# EAGLE design growinov0 (EAGLE 7.1.0)
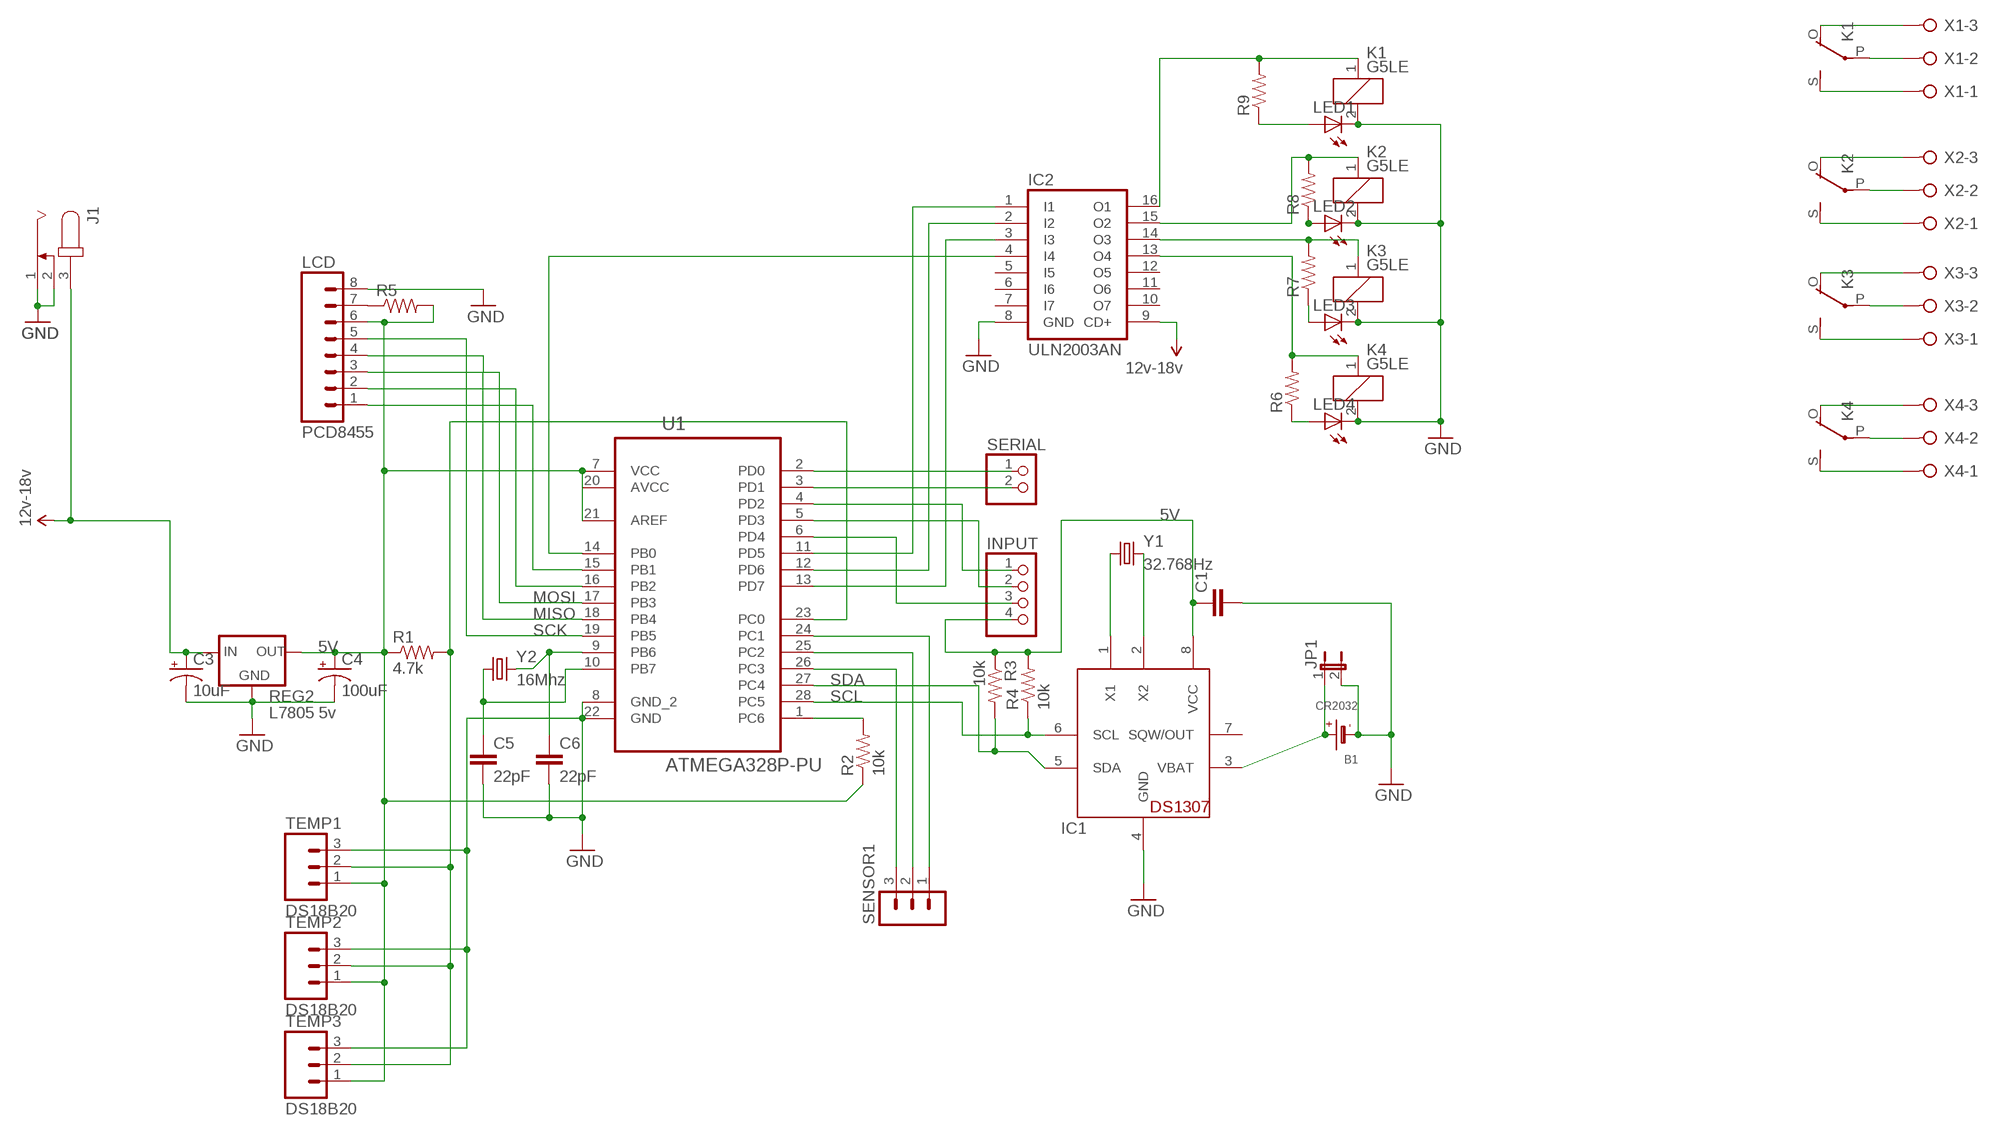
[diagram p0: schematic, sheet 1]

## Parts
B1  CR2032  BATTERYCR2032  [CR2032]
C1  CAPPTH1  [CAP-PTH-5MM]
C3  10uF  CAP_POLPTH2  [CPOL-RADIAL-10UF-25V]
C4  100uF  CAP_POLPTH1  [CPOL-RADIAL-100UF-25V]
C5  22pF  CAPKIT  [CAP-PTH-SMALL-KIT]
C6  22pF  CAPKIT  [CAP-PTH-SMALL-KIT]
IC1  DS1307  [DIL08]
IC2  ULN2003AN  [DIL16]
INPUT  PINHD-1X4  [1X04]
J1  JACK-PLUG0  [SPC4077]
JP1  JUMPER-2PTH  [1X02]
K1  G5LE  [G5LE]
K2  G5LE  [G5LE]
K3  G5LE  [G5LE]
K4  G5LE  [G5LE]
LCD  PCD8455  M081X08  [1X08]
LED1  LED3MM  [LED3MM]
LED2  LED3MM  [LED3MM]
LED3  LED3MM  [LED3MM]
LED4  LED3MM  [LED3MM]
R1  4.7k  RESISTORPTH-1/4W  [AXIAL-0.4]
R2  10k  RESISTORPTH-1/4W  [AXIAL-0.4]
R3  10k  RESISTORPTH-1/4W  [AXIAL-0.4]
R4  10k  RESISTORPTH-1/4W  [AXIAL-0.4]
R5  RESISTORPTH-1/4W-VERT  [AXIAL-0.1]
R6  RESISTORPTH-1/4W-VERT  [AXIAL-0.1]
R7  RESISTORPTH-1/4W-VERT  [AXIAL-0.1]
R8  RESISTORPTH-1/4W-VERT  [AXIAL-0.1]
R9  RESISTORPTH-1/4W-VERT  [AXIAL-0.1]
REG2  L7805 5v  V_REG_78XXSIDE  [78XXL]
SENSOR1  MA03-1  [MA03-1]
SERIAL  PINHD-1X2  [1X02]
TEMP1  DS18B20  M03POLAR  [MOLEX-1X3]
TEMP2  DS18B20  M03POLAR  [MOLEX-1X3]
TEMP3  DS18B20  M03POLAR  [MOLEX-1X3]
U1  ATMEGA328P-PU  [DIP254P762X457-28]
X1  W237-3E  [W237-3E]
X2  W237-3E  [W237-3E]
X3  W237-3E  [W237-3E]
X4  W237-3E  [W237-3E]
Y1  32.768Hz  CRYSTALTC26H  [TC26H]
Y2  16Mhz  CRYSTALHC49US  [HC49US]

## Nets
5V: C1.1 C4.1(+) IC1.8(VCC) INPUT.4 LCD.6 R1.P$1 R2.P$1 R3.P$1 R4.P$2 R5.P$2 REG2.OUT TEMP1.1 TEMP2.1 TEMP3.1 U1.7(VCC) U1.20(AVCC) U1.21(AREF)
GND: B1.- C1.2 C3.2(-) C4.2(-) C5.2 C6.2 IC1.4(GND) IC2.8(GND) J1.1 J1.2 JP1.2 K1.2 K2.2 K3.2 K4.2 LCD.8 LED1.K(C) LED2.K(C) LED3.K(C) LED4.K(C) REG2.GND TEMP1.3 TEMP2.3 TEMP3.3 U1.8(GND_2) U1.22(GND)
MISO: LCD.4 U1.18(PB4)
MOSI: LCD.3 U1.17(PB3)
N$1: B1.+ IC1.3(VBAT) JP1.1
N$2: R1.P$2 TEMP1.2 TEMP2.2 TEMP3.2 U1.23(PC0)
N$3: IC1.1(X1) Y1.1
N$4: IC1.2(X2) Y1.2
N$5: R2.P$2 U1.1(PC6)
N$6: K1.O(2:O) X1.3
N$7: IC2.1(I1) U1.11(PD5)
N$8: IC2.2(I2) U1.12(PD6)
N$9: IC2.3(I3) U1.13(PD7)
N$10: IC2.4(I4) U1.14(PB0)
N$11: K1.S(2:S) X1.1
N$12: C6.1 U1.9(PB6) Y2.2
N$13: C5.1 U1.10(PB7) Y2.1
N$14: LCD.2 U1.16(PB2)
N$15: LCD.1 U1.15(PB1)
N$16: IC2.16(O1) K1.1 R9.P$2
N$17: IC2.15(O2) K2.1 R8.P$2
N$18: IC2.14(O3) K3.1 R7.P$2
N$19: IC2.13(O4) K4.1 R6.P$2
N$21: K1.P(2:P) X1.2
N$22: K4.O(2:O) X4.3
N$23: K4.P(2:P) X4.2
N$24: K4.S(2:S) X4.1
N$25: K3.S(2:S) X3.1
N$26: K3.P(2:P) X3.2
N$27: K3.O(2:O) X3.3
N$28: K2.S(2:S) X2.1
N$29: K2.P(2:P) X2.2
N$30: K2.O(2:O) X2.3
N$31: SERIAL.1 U1.2(PD0)
N$32: SERIAL.2 U1.3(PD1)
N$33: INPUT.1 U1.4(PD2)
N$34: INPUT.2 U1.5(PD3)
N$35: INPUT.3 U1.6(PD4)
N$36: SENSOR1.1 U1.24(PC1)
N$37: SENSOR1.2 U1.25(PC2)
N$38: SENSOR1.3 U1.26(PC3)
N$39: LCD.7 R5.P$1
N$40: LED2.A R8.P$1
N$41: LED4.A R6.P$1
N$42: LED3.A R7.P$1
N$43: LED1.A R9.P$1
SCK: LCD.5 U1.19(PB5)
SCL: IC1.6(SCL) R4.P$1 U1.28(PC5)
SDA: IC1.5(SDA) R3.P$2 U1.27(PC4)
VIN: C3.1(+) IC2.9(CD+) J1.3 REG2.IN ; supply symbol labelled 12v-18v
Unconnected: IC1.7(SQW/OUT) IC2.5(I5) IC2.6(I6) IC2.7(I7) IC2.10(O7) IC2.11(O6) IC2.12(O5)

## Library data of the parts
B1 = microbuilder:BATTERY: CR1220 SMT - Digikey: 3001K-ND
C1 = SparkFun-Capacitors:CAP: Capacitor Standard 0603 ceramic capacitor, and 0.1" leaded capacitor.
C3 C4 = SparkFun-Passives:CAP_POL: Capacitor Polarized These are standard SMD and PTH capacitors. Normally 10uF, 47uF, and 100uF in electrolytic and tantalum varieties. Always verify the external diameter of the through hole cap, it varies with capacity, voltage, and manufacturer. The EIA devices should be standard.
C5 C6 = SparkFun-Passives:CAP: Capacitor Standard 0603 ceramic capacitor, and 0.1" leaded capacitor.
IC1 = adafruit:DS1307: DS1307 Real time clock (RTC) with battery backup ability. Talk to it via i2c
IC2 = uln-udn:ULN2003A: DRIVER ARRAY
INPUT = pinhead:PINHD-1X4: PIN HEADER
J1 = con-jack:JACK-PLUG: DC POWER JACK Power Jack, DC, Right Angle, Through Hole, Rated 5A at 16VDC, PC Terminals Distributor: Farnell (www.Farnell.de) Drawing: 84N1161.pdf / 84N1162.pdf Manufacturer: SPC Technology (www.spctechnology.com) Type: SPC4077 / SPC 4078; OC_FARNELL: unknown; OC_NEWARK: unknown
JP1 = SparkFun-Retired:JUMPER-2: Jumper Basic 0.1" spaced jumper. Use with breakaway headers.
K1-K4 = relay:G5LE: RELAY 1 x switch, 10 A/120 V AC, 8 A/30 V DC, Omron; OC_FARNELL: unknown; OC_NEWARK: unknown
LCD = SparkFun-Connectors:M08: Header 8 Standard 8-pin 0.1" header. Use with straight break away headers (SKU : PRT-00116), right angle break away headers (PRT-00553), swiss pins (PRT-00743), machine pins (PRT-00117), and female headers (PRT-00115).
LED1-LED4 = led:LED: LED OSRAM: - CHIPLED LG R971, LG N971, LY N971, LG Q971, LY Q971, LO R971, LY R971 LH N974, LH R974 LS Q976, LO Q976, LY Q976 LO Q996 - Hyper CHIPLED LW Q18S LB Q993, LB Q99A, LB R99A - SideLED LS A670, LO A670, LY A670, LG A670, LP A670 LB A673, LV A673, LT A673, LW A673 LH A674 LY A675 LS A676, LA A676, LO A676, LY A676, LW A676 LS A679, LY A679, LG A679 - Hyper Micro SIDELED® LS Y876, LA Y876, LO Y876, LY Y876 LT Y87S - SmartLED LW L88C, LW L88S LB L89C, LB L89S, LG L890 LS L89K, LO L89K, LY L89K LS L896, LA L896, LO L896, LY L896 - TOPLED LS T670, LO T670, LY T670, LG T670, LP T670 LSG T670, LSP T670, LSY T670, LOP T670, LYG T670 LG T671, LOG T671, LSG T671 LB T673, LV T673, LT T673, LW T673 LH T674 LS T676, LA T676, LO T676, LY T676, LB T676, LH T676, LSB T676, LW T676 LB T67C, LV T67C, LT T67C, LS T67K, LO T67K, LY T67K, LW E67C LS E67B, LA E67B, LO E67B, LY E67B, LB E67C, LV E67C, LT E67C LW T67C LS T679, LY T679, LG T679 LS T770, LO T770, LY T770, LG T770, LP T770 LB T773, LV T773, LT T773, LW T773 LH T774 LS E675, LA E675, LY E675, LS T675 LS T776, LA T776, LO T776, LY T776, LB T776 LHGB T686 LT T68C, LB T68C - Hyper Mini TOPLED® LB M676 - Mini TOPLED Santana® LG M470 LS M47K, LO M47K, LY M47K Source: http://www.osram.convergy.de LUXEON: - LUMILED® LXK2-PW12-R00, LXK2-PW12-S00, LXK2-PW14-U00, LXK2-PW14-V00 LXK2-PM12-R00, LXK2-PM12-S00, LXK2-PM14-U00 LXK2-PE12-Q00, LXK2-PE12-R00, LXK2-PE12-S00, LXK2-PE14-T00, LXK2-PE14-U00 LXK2-PB12-K00, LXK2-PB12-L00, LXK2-PB12-M00, LXK2-PB14-N00, LXK2-PB14-P00, LXK2-PB14-Q00 LXK2-PR12-L00, LXK2-PR12-M00, LXK2-PR14-Q00, LXK2-PR14-R00 LXK2-PD12-Q00, LXK2-PD12-R00, LXK2-PD12-S00 LXK2-PH12-R00, LXK2-PH12-S00 LXK2-PL12-P00, LXK2-PL12-Q00, LXK2-PL12-R00 Source: www.luxeon.com KINGBRIGHT: KA-3528ASYC Source: www.kingbright.com
R1 R3 R4 = SparkFun-Passives:RESISTOR: Resistor Basic schematic elements and footprints for 0603, 1206, and PTH resistors.
R2 R5-R9 = SparkFun-Resistors:RESISTOR: Resistor Basic schematic elements and footprints for 0603, 1206, and PTH resistors.
REG2 = SparkFun-PowerIC:V_REG_78XX: Voltage Regulator Standard 7805 5V regulator. IGO (Input Ground Output). Spark Fun Electronics SKU : COM-00107
SENSOR1 = con-lstb:MA03-1: PIN HEADER; OC_FARNELL: unknown; OC_NEWARK: unknown
SERIAL = pinhead:PINHD-1X2: PIN HEADER
TEMP1-TEMP3 = SparkFun-Connectors:M03: Header 3 Standard 3-pin 0.1" header. Use with straight break away headers (SKU : PRT-00116), right angle break away headers (PRT-00553), swiss pins (PRT-00743), machine pins (PRT-00117), and female headers (PRT-00115). Molex polarized connector foot print use with SKU : PRT-08232 with associated crimp pins and housings.
U1 = Atmel_By_element14_Batch_1-00:ATMEGA328P-PU: 8-bit Microcontroller with In-System Programmable Flash; MPN: ATMEGA328P-PU; OC_FARNELL: 1715487; OC_NEWARK: 15R0268; PACKAGE: PDIP-28; SUPPLIER: Atmel
X1-X4 = con-wago-508:W237-3E: WAGO SREW CLAMP; OC_FARNELL: unknown; OC_NEWARK: unknown
Y1 Y2 = SparkFun-FreqCtrl:CRYSTAL: Various standard crystals. Proven footprints. Spark Fun Electronics SKU : COM-00534

## Board
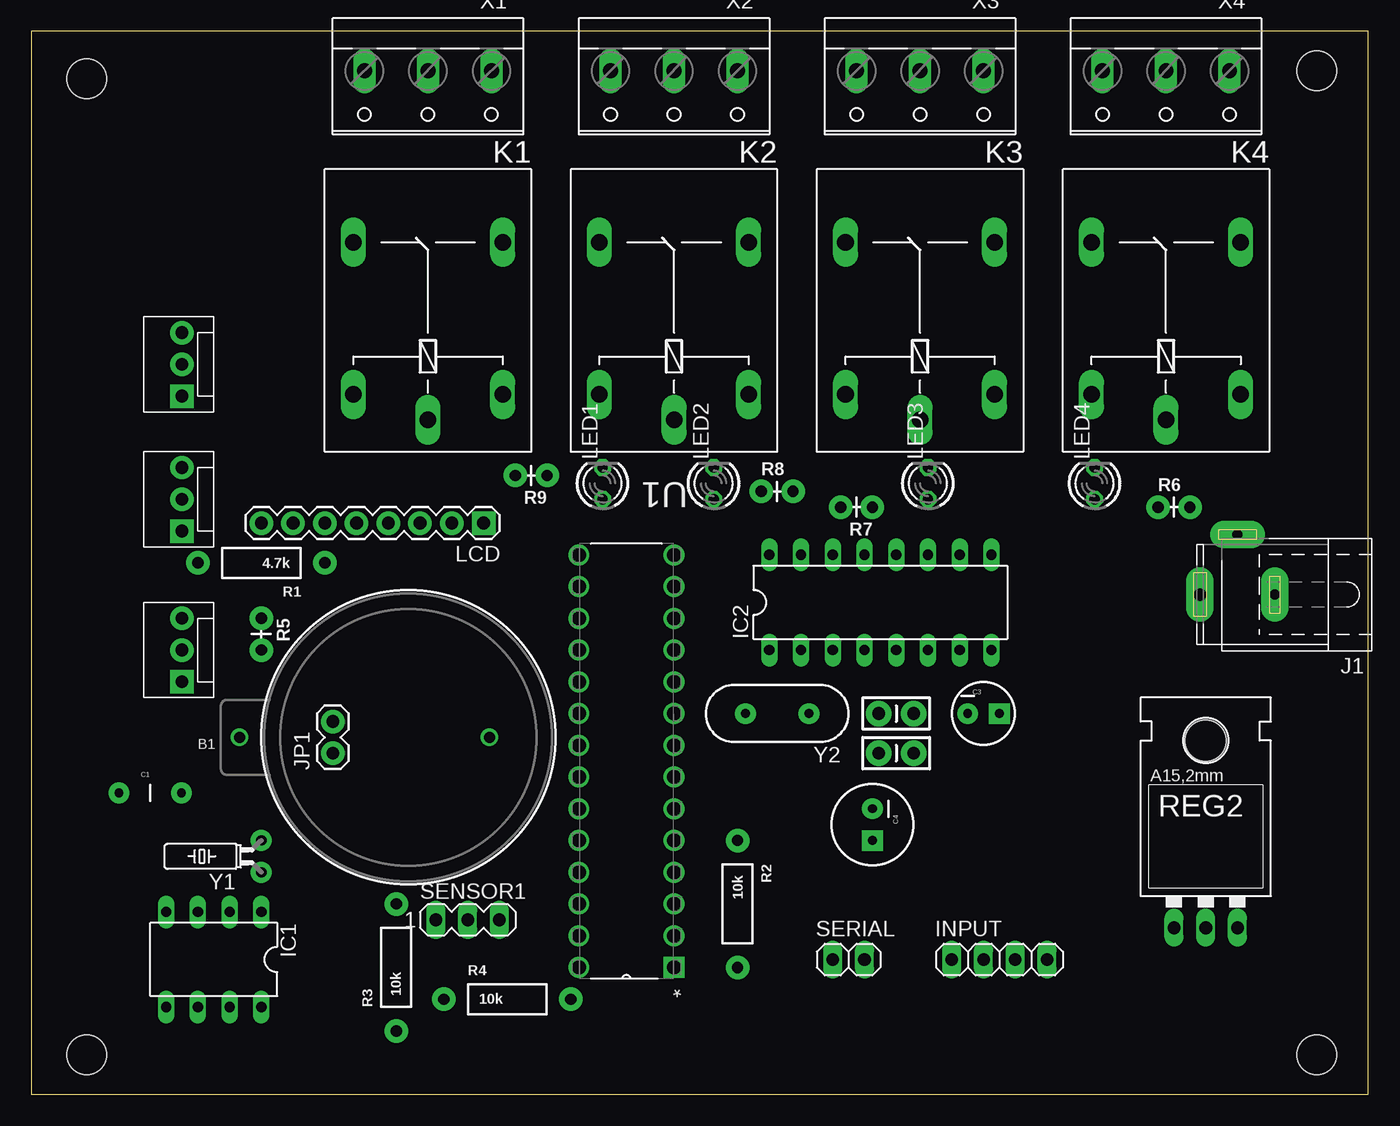
[diagram p1: board, top side]
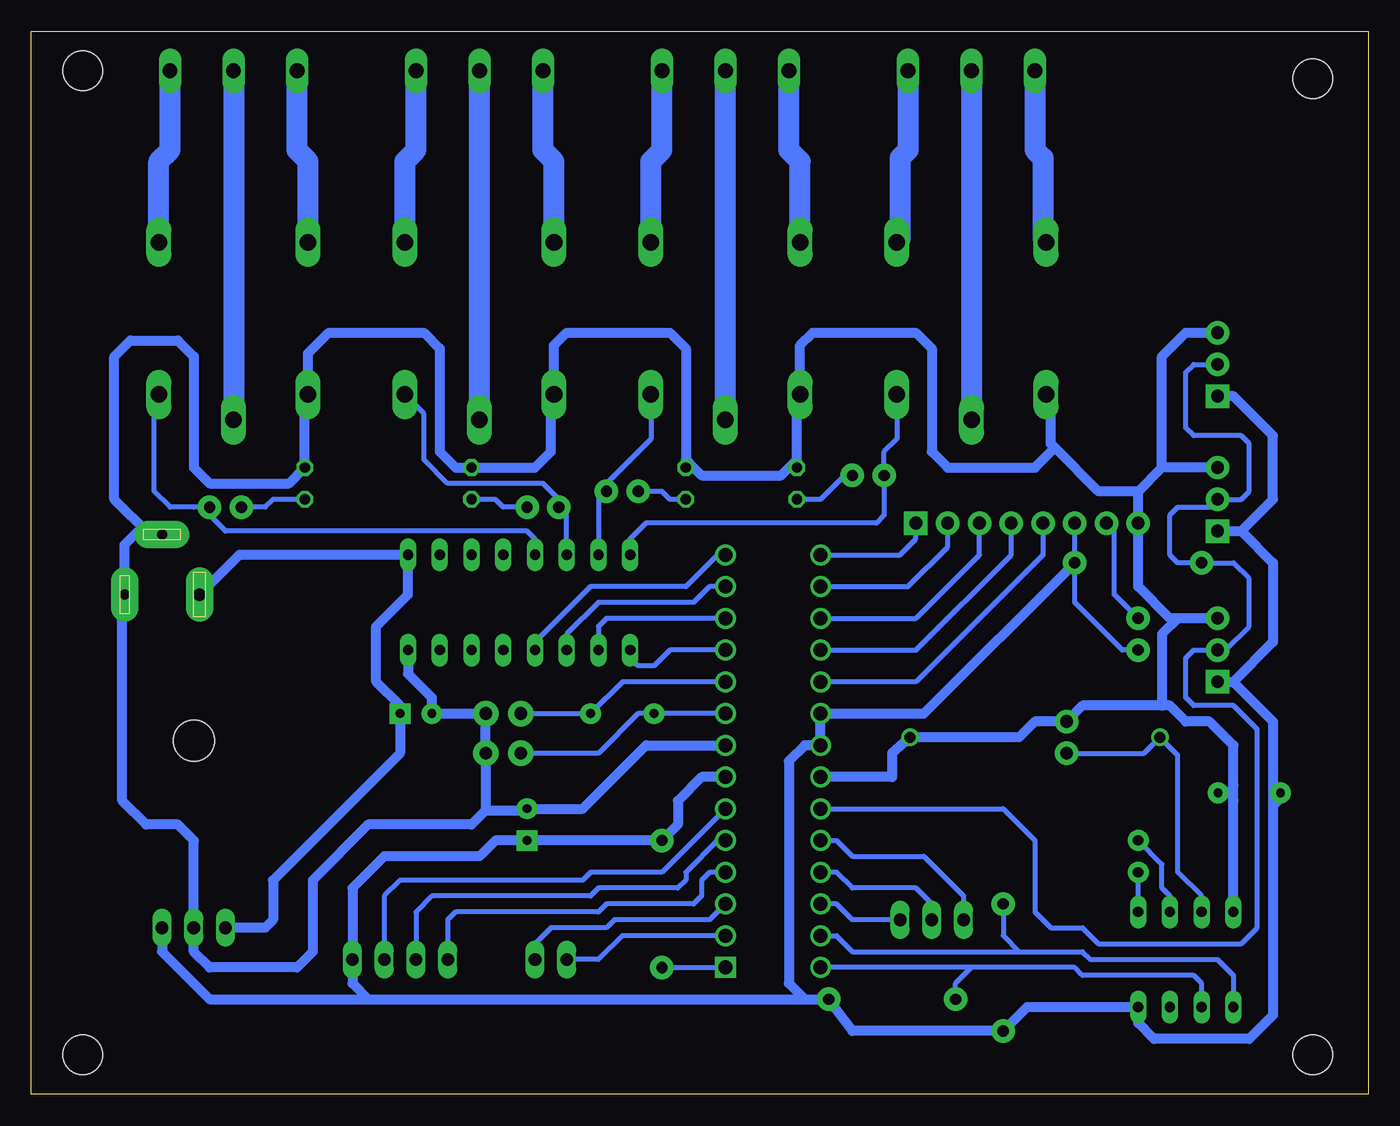
[diagram p2: board, bottom side, seen from below]

Size 106.98 x 85.08 mm. Coordinates in mm from the lower left corner, seen from the top.
Outline: 0,0 106.98,0 106.98,85.08 0,85.08 0,0
Copper layers (1*16): Top 0.035mm / dielectric 1.5mm / Bottom 0.035mm
Design rules "default": minimum track width 10mil, minimum drill 24mil, track to track 8mil, track to pad 8mil, pad to pad 8mil, via to via 8mil, smd to smd 8mil, copper to edge 40mil, drill to drill 8mil, minimum pad ring 10mil, minimum via ring 8mil, stop-mask expansion 4mil, vias tented up to drill 0mil, thermal gap 10mil
Holes 3.2 mm at 4.45,81.28 102.87,81.91 102.87,3.17 4.45,3.17

### Footprints (pad centres in the part's own frame; a part is rotated, then mirrored left to right if it is on the bottom)
CR2032 = drill 0.9: + 10,0; - -10,0
CAP-PTH-5MM = drill 0.7 pad 1.651: 1 -2.5,0; 2 2.5,0
CPOL-RADIAL-10UF-25V = drill 0.7 pad 1.651 square: 1 1.27,0 | drill 0.7 pad 1.651: 2 -1.27,0
CPOL-RADIAL-100UF-25V = drill 0.7 pad 1.651 square: 1 1.27,0 | drill 0.7 pad 1.651: 2 -1.27,0
CAP-PTH-SMALL-KIT = drill 1.016 pad 2.032: 1 -1.397,0; 2 1.397,0
DIL08 = drill 0.813 long: 1 -3.81,-3.81; 2 -1.27,-3.81; 3 1.27,-3.81; 4 3.81,-3.81; 5 3.81,3.81; 6 1.27,3.81; 7 -1.27,3.81; 8 -3.81,3.81
DIL16 = drill 0.813 long: 1 -8.89,-3.81; 2 -6.35,-3.81; 3 -3.81,-3.81; 4 -1.27,-3.81; 5 1.27,-3.81; 6 3.81,-3.81; 7 6.35,-3.81; 8 8.89,-3.81; 9 8.89,3.81; 10 6.35,3.81; 11 3.81,3.81; 12 1.27,3.81; 13 -1.27,3.81; 14 -3.81,3.81; 15 -6.35,3.81; 16 -8.89,3.81
1X04 = drill 1.016 long: 1 -3.81,0; 2 -1.27,0; 3 1.27,0; 4 3.81,0
SPC4077 = drill 0.8 pad 2.184 long: 1 -3,0; 2 0,-4.8 | drill 1 pad 2.184 long: 3 3,0
1X02 = drill 1.016 pad 1.88: 1 0,0; 2 2.54,0
G5LE = drill 1.321 long: 1 -7.493,-5.969; 2 -7.493,5.969; O 4.699,5.969; P -9.525,0; S 4.699,-5.969
1X08 = drill 1.016 pad 1.88 square: 1 0,0 | drill 1.016 pad 1.88: 2 2.54,0; 3 5.08,0; 4 7.62,0; 5 10.16,0; 6 12.7,0; 7 15.24,0; 8 17.78,0
LED3MM = drill 0.813 octagon: A -1.27,0; K 1.27,0
AXIAL-0.4 = drill 0.9 pad 1.88: P$1 -5.08,0; P$2 5.08,0
AXIAL-0.1 = drill 0.9 pad 1.88: P$1 0,0; P$2 2.54,0
78XXL = drill 1.016 long: GND 0,-3.81; IN -2.54,-3.81; OUT 2.54,-3.81 | hole 3.302: 0,11.176
MA03-1 = drill 1.016 long: 1 -2.54,0; 2 0,0; 3 2.54,0
1X02' = drill 1.016 long: 1 -1.27,0; 2 1.27,0
MOLEX-1X3 = drill 1.016 pad 1.88 square: 1 0,0 | drill 1.016 pad 1.88: 2 2.54,0; 3 5.08,0
DIP254P762X457-28 = drill 1.118 square: 1 -7.62,33.02 | drill 1.118: 2 -7.62,30.48; 3 -7.62,27.94; 4 -7.62,25.4; 5 -7.62,22.86; 6 -7.62,20.32; 7 -7.62,17.78; 8 -7.62,15.24; 9 -7.62,12.7; 10 -7.62,10.16; 11 -7.62,7.62; 12 -7.62,5.08; 13 -7.62,2.54; 14 -7.62,0; 15 0,0; 16 0,2.54; 17 0,5.08; 18 0,7.62; 19 0,10.16; 20 0,12.7; 21 0,15.24; 22 0,17.78; 23 0,20.32; 24 0,22.86; 25 0,25.4; 26 0,27.94; 27 0,30.48; 28 0,33.02
W237-3E = drill 1.194 long: 1 -5.08,-0.635; 2 0,-0.635; 3 5.08,-0.635
TC26H = drill 0.813 pad 1.676: 1 -1.27,0; 2 1.27,0
HC49US = drill 0.7 pad 1.651: 1 -2.54,0; 2 2.54,0

### Placement (x,y rotation side)
B1  26.67,28.58 180 top
C1  9.53,24.13 0 top
C3  76.2,30.48 0 top
C4  67.31,21.59 270 top
C5  69.22,30.48 0 top
C6  69.22,27.3 0 top
IC1  14.61,10.79 180 top
IC2  67.95,39.37 0 top
INPUT  77.47,10.79 0 top
J1  96.52,40 180 top
JP1  24.13,27.3 90 top
K1  31.75,63.5 90 top
K2  51.44,63.5 90 top
K3  71.12,63.5 90 top
K4  90.8,63.5 90 top
LCD  36.2,45.72 180 top
LED1  45.72,48.89 90 top
LED2  54.61,48.89 90 top
LED3  71.75,48.89 90 top
LED4  85.09,48.89 90 top
R1  18.41,42.55 180 top
R2  56.52,15.24 270 top
R3  29.21,10.16 90 top
R4  38.1,7.62 0 top
R5  18.41,38.1 270 top
R6  90.17,46.99 0 top
R7  67.31,46.99 180 top
R8  58.42,48.26 0 top
R9  41.27,49.53 180 top
REG2  93.98,17.14 0 top
SENSOR1  34.93,13.97 0 top
SERIAL  [1X02']  65.41,10.79 0 top
TEMP1  12.07,55.88 90 top
TEMP2  12.07,45.09 90 top
TEMP3  12.07,33.02 90 top
U1  43.81,43.18 180 top
X1  31.75,81.28 180 top
X2  51.44,81.28 180 top
X3  71.12,81.28 180 top
X4  90.8,81.28 180 top
Y1  18.41,19.05 90 top
Y2  59.69,30.48 180 top

### Tracks (layer width: path | path; a pad name or v marks a point on that pad's centre or on a via)
5V
  Bottom 0.406: LCD.6 R1.P$1 23.5,39.37 19.68,35.56 R5.P$2 | C1.1 7.03,23.45 7.62,22.86 | 6.99,24.13 7.62,24.77
  Bottom 0.813: R1.P$1 35.56,30.48 U1.20 U1.21 45.09,27.94 46.35,26.67 46.35,8.89 45.09,7.62 | U1.7 53.34,25.4 55.24,23.49 55.24,21.59 R2.P$1 C4.1 69.85,20.32 71.12,19.05 78.74,19.05 81.28,16.51 INPUT.4 81.28,8.89 80.01,7.62 | TEMP3.1 10.79,33.02 | 10.79,33.02 7.62,29.84 7.62,24.77 7.62,22.86 7.62,6.35 9.53,4.45 17.14,4.45 18.41,5.71 IC1.8 27.3,6.99 R3.P$1 41.27,5.08 R4.P$2 45.09,7.62 | 10.16,45.09 7.62,42.55 7.62,36.2 10.79,33.02 | TEMP2.1 10.16,45.09 | 10.16,45.09 7.62,47.62 7.62,52.7 10.79,55.88 TEMP1.1 | 80.01,7.62 45.09,7.62 | REG2.OUT 96.52,11.43 92.71,7.62 80.01,7.62
GND
  Bottom 0.406: 11.43,24.13 C1.2 12.07,24.13 | 11.43,24.13 10.79,24.77 | 11.43,24.13 10.79,23.49 | LED1.K 46.04,50.48 | LED2.K 54.29,50.48
  Bottom 0.813: IC2.8 76.83,33.66 74.93,31.75 C3.2 C5.2 C6.2 70.61,22.73 | 70.61,22.73 71.75,21.59 80.01,21.59 84.45,17.14 84.45,11.43 85.72,10.16 92.71,10.16 93.98,11.43 REG2.GND 93.98,20.32 95.25,21.59 97.79,21.59 99.69,23.49 99.69,40 J1.1 99.52,43.99 98.42,45.09 96.8,45.09 J1.2 97.51,44.8 100.33,47.62 100.33,59.05 99.06,60.32 95.25,60.32 93.98,59.05 93.98,50.16 92.71,48.89 86.36,48.89 LED4.K 85.09,55.75 K4.2 84.84,59.31 83.19,60.96 75.56,60.96 74.3,59.69 74.3,51.43 73.03,50.16 72.39,50.16 LED3.K 66.67,50.16 65.41,51.43 65.41,55.75 K3.2 65.15,59.94 64.14,60.96 55.88,60.96 54.61,59.69 54.61,50.8 54.29,50.48 53.34,49.53 46.99,49.53 46.04,50.48 45.72,50.8 45.72,55.75 K2.2 45.47,59.94 44.45,60.96 36.2,60.96 34.93,59.69 34.93,51.43 33.66,50.16 26.67,50.16 25.08,51.75 | 70.61,22.73 67.44,22.73 C4.2 62.87,22.86 57.78,27.94 U1.8 | IC1.4 10.79,23.49 10.79,24.77 10.79,27.94 12.7,29.84 14.61,29.84 15.88,31.12 16.51,31.12 | 16.51,31.12 22.86,31.12 JP1.2 26.67,29.84 27.94,28.58 B1.- 38.1,27.3 38.1,25.4 U1.22 | TEMP3.3 15.24,38.1 | 15.24,38.1 16.51,36.83 16.51,31.12 | 15.24,38.1 15.88,38.1 18.41,40.64 LCD.8 18.41,48.26 | 18.41,48.26 16.51,50.16 | TEMP2.3 16.51,50.16 | 16.51,50.16 16.51,59.05 14.61,60.96 TEMP1.3 | 18.41,48.26 21.59,48.26 25.08,51.75 | 25.08,51.75 25.4,52.07 25.4,55.63 K1.2
MISO
  Bottom 0.406: U1.18 36.2,35.56 28.57,43.18 LCD.4
MOSI
  Bottom 0.406: U1.17 36.2,38.1 31.11,43.18 LCD.3
N$1
  Bottom 0.406: IC1.3 13.34,15.88 15.24,17.78 15.24,27.15 B1.+ 17.94,27.3 JP1.1
N$2
  Bottom 0.406: TEMP1.2 13.97,58.42 14.61,57.78 14.61,53.34 13.97,52.7 10.16,52.7 9.53,52.07 9.53,48.26 10.16,47.62 TEMP2.2 12.7,46.99 15.24,46.99 15.88,46.35 15.88,43.18 15.24,42.55 R1.P$2 10.79,42.55 9.53,41.27 9.53,37.46 11.43,35.56 TEMP3.2 13.97,35.56 14.61,34.92 14.61,31.75 13.97,31.12 10.79,31.12 8.89,29.21 8.89,13.34 10.16,12.07 21.59,12.07 22.86,13.34 25.4,13.34 26.67,14.61 26.67,20.32 29.21,22.86 U1.23
N$3
  Bottom 0.406: IC1.1 Y1.1
N$4
  Bottom 0.406: IC1.2 15.88,15.88 16.51,16.51 16.51,18.41 Y1.2
N$5
  Bottom 0.406: R2.P$2 U1.1
N$6
  Bottom 1.676: X1.3 26.67,75.56 26.04,74.93 26.04,68.45 K1.O
N$7
  Bottom 0.406: U1.11 55.88,35.56 57.15,34.29 58.42,34.29 59.05,34.92 IC2.1
N$8
  Bottom 0.406: U1.12 60.96,38.1 61.59,37.46 IC2.2
N$9
  Bottom 0.406: U1.13 52.7,40.64 53.98,39.37 61.59,39.37 64.14,36.83 IC2.3
N$10
  Bottom 0.406: U1.14 52.07,43.18 54.61,40.64 62.23,40.64 66.67,36.2 IC2.4
N$11
  Bottom 1.676: X1.1 36.83,75.56 37.47,74.93 37.47,68.45 K1.S
N$12
  Bottom 0.406: U1.9 Y2.2 58.42,30.48 61.59,27.3 C6.1
N$13
  Bottom 0.406: U1.10 59.69,33.02 Y2.1 C5.1
N$14
  Bottom 0.406: U1.16 36.83,40.64 33.66,43.81 LCD.2
N$15
  Bottom 0.406: U1.15 37.47,43.18 36.2,44.45 LCD.1
N$16
  Bottom 0.406: K1.1 37.72,52.45 38.73,51.43 R9.P$2 38.73,46.35 39.37,45.72 57.78,45.72 59.05,44.45 IC2.16
N$17
  Bottom 0.406: K2.1 57.4,52.45 61.59,48.26 | 61.59,48.26 IC2.15 | R8.P$2 61.59,48.26
N$18
  Bottom 0.406: IC2.14 64.14,46.99 | 64.14,46.99 66.04,48.89 73.66,48.89 75.56,50.8 75.56,54.48 K3.1 | 64.14,46.99 R7.P$2
N$19
  Bottom 0.406: IC2.13 66.67,44.45 67.31,45.09 91.44,45.09 93.34,46.99 | 93.34,46.99 93.98,46.99 95.89,46.99 97.16,48.26 97.16,55.12 K4.1 | R6.P$2 93.34,46.99
N$21
  Bottom 1.676: X1.2 K1.P
N$22
  Bottom 1.676: K4.O 84.84,74.68 85.72,75.56 X4.3
N$23
  Bottom 1.676: X4.2 K4.P
N$24
  Bottom 1.676: K4.S 96.77,74.68 95.89,75.56 X4.1
N$25
  Bottom 1.676: K3.S 77.09,74.68 76.2,75.56 X3.1
N$26
  Bottom 1.676: K3.P X3.2
N$27
  Bottom 1.676: K3.O 65.15,74.68 66.04,75.56 X3.3
N$28
  Bottom 1.676: K2.S 57.4,74.68 56.52,75.56 X2.1
N$29
  Bottom 1.676: K2.P X2.2
N$30
  Bottom 1.676: K2.O 45.47,74.68 46.35,75.56 X2.3
N$31
  Bottom 0.406: U1.2 59.69,12.7 61.59,10.79 SERIAL.1
N$32
  Bottom 0.406: U1.3 52.7,13.97 60.33,13.97 60.96,13.34 65.41,13.34 66.67,12.07 SERIAL.2
N$33
  Bottom 0.406: U1.4 52.7,17.78 53.34,17.14 53.34,15.88 53.98,15.24 60.96,15.24 61.59,14.61 73.03,14.61 73.66,13.97 INPUT.1
N$34
  Bottom 0.406: U1.5 52.07,20.32 54.61,17.78 54.61,17.14 55.24,16.51 61.59,16.51 62.23,15.88 74.93,15.88 76.2,14.61 INPUT.2
N$35
  Bottom 0.406: U1.6 56.52,17.78 62.23,17.78 62.87,17.14 77.47,17.14 78.74,15.88 INPUT.3
N$36
  Bottom 0.406: U1.24 42.55,20.32 41.27,19.05 35.56,19.05 32.38,15.88 SENSOR1.1
N$37
  Bottom 0.406: SENSOR1.2 34.93,15.24 36.2,16.51 41.27,16.51 42.55,17.78 U1.25
N$38
  Bottom 0.406: SENSOR1.3 41.27,13.97 42.55,15.24 U1.26
N$39
  Bottom 0.406: R5.P$1 20.32,40 20.32,45.09 LCD.7
N$40
  Bottom 0.406: LED2.A 55.88,47.62 56.52,48.26 R8.P$1
N$41
  Bottom 0.406: LED4.A 87.63,47.62 88.27,46.99 R6.P$1
N$42
  Bottom 0.406: R7.P$1 69.22,46.99 69.85,47.62 LED3.A
N$43
  Bottom 0.406: R9.P$1 41.91,49.53 43.81,47.62 LED1.A
SCK
  Bottom 0.406: LCD.5 26.04,43.18 36.2,33.02 U1.19
SCL
  Bottom 0.406: IC1.6 13.34,8.89 13.97,9.53 22.86,9.53 23.5,10.16 31.75,10.16 | 31.75,10.16 U1.28 | R4.P$1 33.02,8.89 31.75,10.16
SDA
  Bottom 0.406: U1.27 42.55,12.7 41.27,11.43 27.94,11.43 | 27.94,11.43 22.86,11.43 22.23,10.79 12.07,10.79 10.79,9.53 IC1.5 | R3.P$2 29.21,12.7 27.94,11.43
VIN
  Bottom 0.813: J1.3 90.34,43.18 IC2.9 76.83,40 79.38,37.46 79.38,33.02 77.47,31.12 C3.1 77.47,27.3 87.63,17.14 87.63,13.97 88.27,13.34 REG2.IN